# EAGLE design Tanker_Pertamina3 (EAGLE 7.6.0)
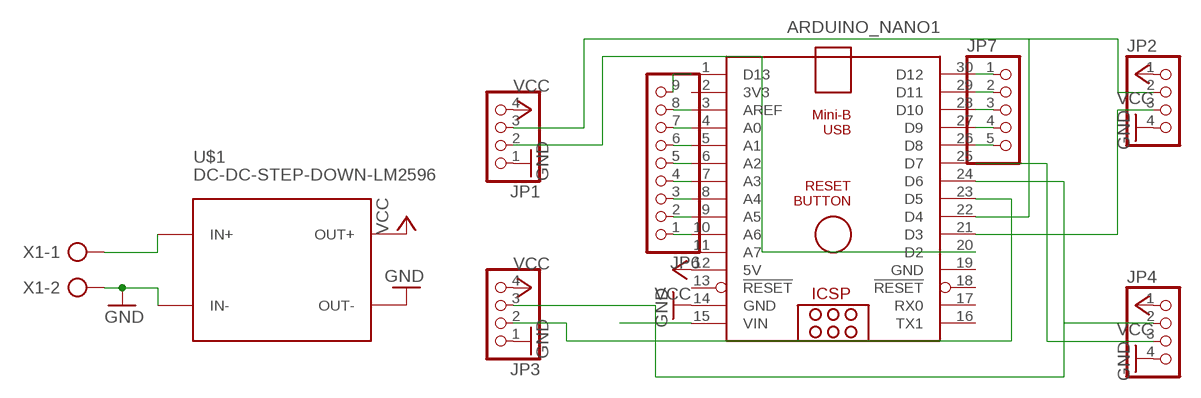
[diagram p0: schematic, sheet 1]

## Parts
ARDUINO_NANO1  ARDUINO_NANO  [ARDUINO_NANO]
JP1  PINHD-1X4  [1X04]
JP2  PINHD-1X4  [1X04]
JP3  PINHD-1X4  [1X04]
JP4  PINHD-1X4  [1X04]
JP6  PINHD-1X9  [1X09]
JP7  PINHD-1X5  [1X05]
U$1  DC-DC-STEP-DOWN-LM2596  [DC-DC-STEP-DOWN-LM2596]
X1  AK300/2  [AK300/2]

## Nets
7-12V: ARDUINO_NANO1.15(VIN)
GND: ARDUINO_NANO1.14(GND) JP1.1 JP2.4 JP3.1 JP4.4 U$1.IN- U$1.OUT- X1.2
N$1: ARDUINO_NANO1.20(D2) JP1.2
N$2: ARDUINO_NANO1.10(A6) JP6.1
N$3: ARDUINO_NANO1.21(D3) JP2.3
N$4: ARDUINO_NANO1.23(D5) JP3.2
N$5: ARDUINO_NANO1.25(D7) JP4.3
N$6: ARDUINO_NANO1.9(A5) JP6.2
N$7: ARDUINO_NANO1.8(A4) JP6.3
N$8: ARDUINO_NANO1.7(A3) JP6.4
N$9: ARDUINO_NANO1.6(A2) JP6.5
N$10: ARDUINO_NANO1.5(A1) JP6.6
N$11: ARDUINO_NANO1.4(A0) JP6.7
N$12: ARDUINO_NANO1.3(AREF) JP6.8
N$13: ARDUINO_NANO1.1(D13) JP6.9
N$14: ARDUINO_NANO1.30(D12) JP7.1
N$15: ARDUINO_NANO1.29(D11) JP7.2
N$16: ARDUINO_NANO1.28(D10) JP7.3
N$17: ARDUINO_NANO1.27(D9) JP7.4
N$18: ARDUINO_NANO1.26(D8) JP7.5
N$19: U$1.IN+ X1.1
TRIG_DEPAN: ARDUINO_NANO1.22(D4) JP1.3 JP2.2
TRIGGER_BELAKANG: ARDUINO_NANO1.24(D6) JP3.3 JP4.2
VCC: ARDUINO_NANO1.12(5V) JP1.4 JP2.1 JP3.4 JP4.1 U$1.OUT+
Unconnected: ARDUINO_NANO1.2(3V3) ARDUINO_NANO1.11(A7) ARDUINO_NANO1.13(!RESET) ARDUINO_NANO1.16(TX1) ARDUINO_NANO1.17(RX0) ARDUINO_NANO1.18(!RESET)

## Power pins joined to a net without a drawn wire
GND: ARDUINO_NANO1.19(GND)

## Library data of the parts
ARDUINO_NANO1 = ArduinoNanoV30:ARDUINO_NANO: Arduino Nano V3.0 Overview: The Arduino Nano is a small, complete, and breadboard-friendly board based on the ATmega328 (Arduino Nano 3.x) or ATmega168 (Arduino Nano 2.x). It has more or less the same functionality of the Arduino Duemilanove, but in a different package. It lacks only a DC power jack, and works with a Mini-B USB cable instead of a standard one. The Nano was designed and is being produced by Gravitech. Specifications: Microcontroller Atmel ATmega168 or ATmega328 Operating Voltage (logic level) 5 V Input Voltage (recommended) 7-12 V Input Voltage (limits) 6-20 V Digital I/O Pins 14 (of which 6 provide PWM output) Analog Input Pins 8 DC Current per I/O Pin 40 mA Flash Memory 16 KB (ATmega168) or 32 KB (ATmega328) of which 2 KB used by bootloader SRAM 1 KB (ATmega168) or 2 KB (ATmega328) EEPROM 512 bytes (ATmega168) or 1 KB (ATmega328) Clock Speed 16 MHz Dimensions 0.73" x 1.70" Length 45 mm Width 18 mm Weigth 5 g Power: The Arduino Nano can be powered via the Mini-B USB connection, 6-20V unregulated external power supply (pin 30), or 5V regulated external power supply (pin 27). The power source is automatically selected to the highest voltage source. Memory: The ATmega168 has 16 KB of flash memory for storing code (of which 2 KB is used for the bootloader); the ATmega328 has 32 KB, (also with 2 KB used for the bootloader). The ATmega168 has 1 KB of SRAM and 512 bytes of EEPROM (which can be read and written with the EEPROM library); the ATmega328 has 2 KB of SRAM and 1 KB of EEPROM. Input and Output: Each of the 14 digital pins on the Nano can be used as an input or output, using pinMode(), digitalWrite(), and digitalRead() functions. They operate at 5 volts. Each pin can provide or receive a maximum of 40 mA and has an internal pull-up resistor (disconnected by default) of 20-50 kOhms. In addition, some pins have specialized functions. Visit Arduino - ArduinoBoardNano <https://www.arduino.cc/en/Main/ArduinoBoardNano>
JP1-JP4 = pinhead:PINHD-1X4: PIN HEADER
JP6 = pinhead:PINHD-1X9: PIN HEADER
JP7 = pinhead:PINHD-1X5: PIN HEADER
U$1 = diy-modules:DC-DC-STEP-DOWN-LM2596: DC/DC Step-Down Regulator based on LM2596-ADJ chip LM2596 datasheet available here: http://www.ti.com/lit/ds/symlink/lm2596.pdf Click here to find device on ebay.com <http://www.ebay.com/sch/lm2596+power+regulator>
X1 = con-ptr500:AK300/2: CONNECTOR; OC_FARNELL: unknown; OC_NEWARK: unknown

## Board
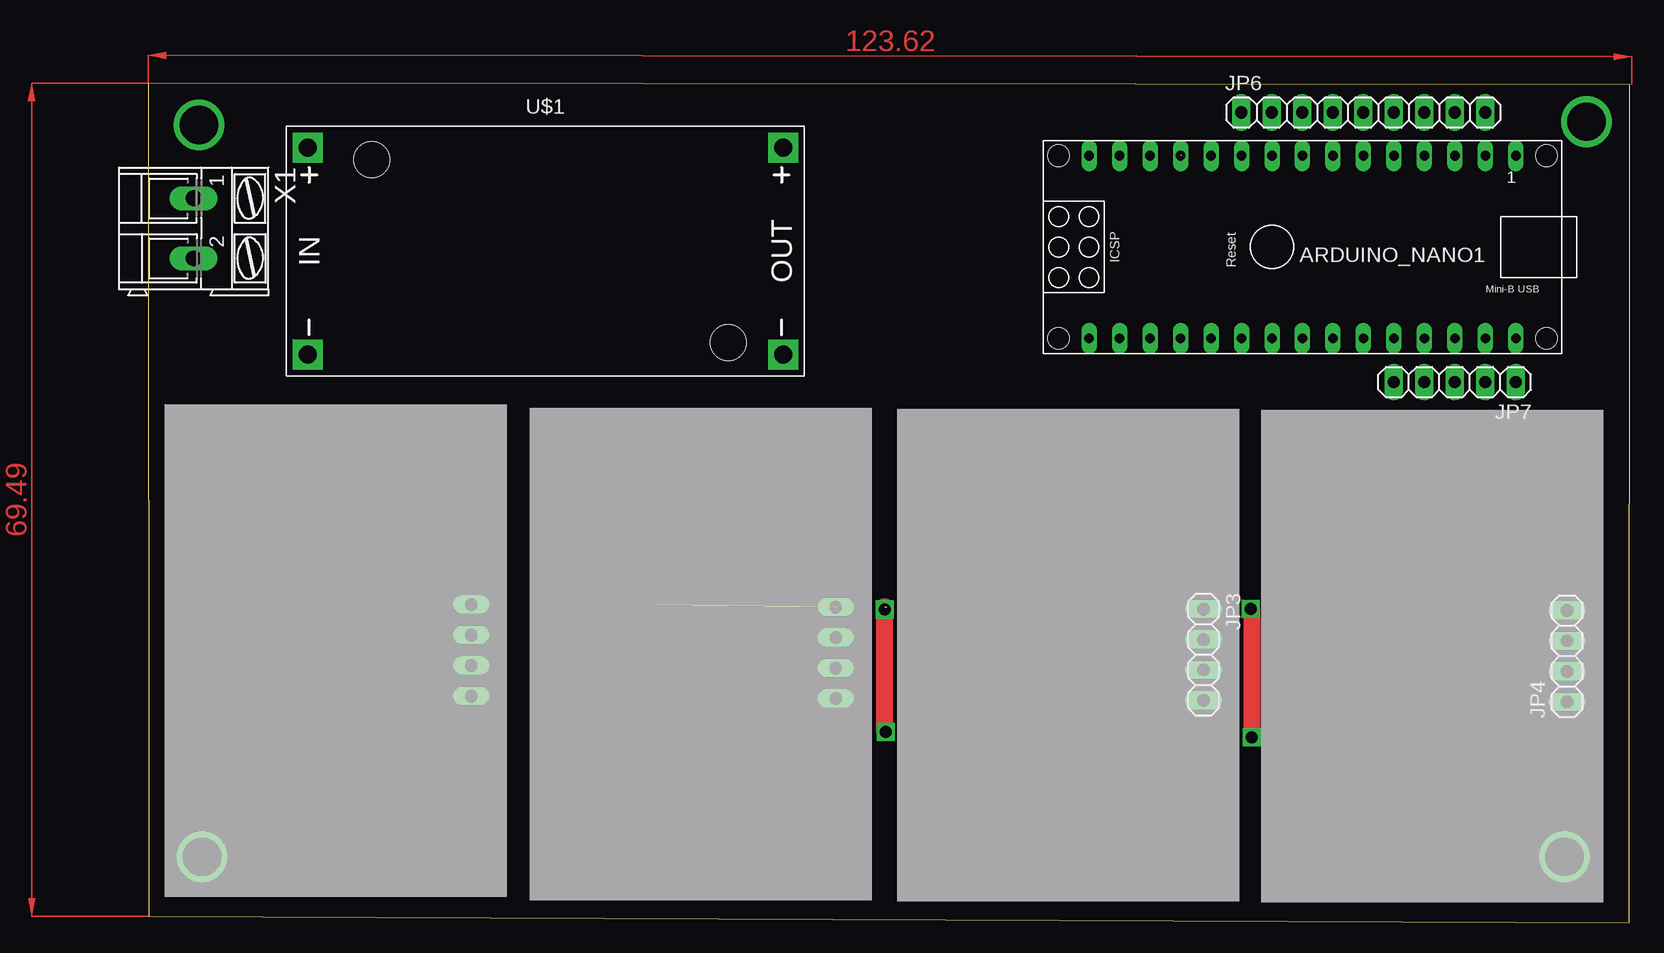
[diagram p1: board, top side]
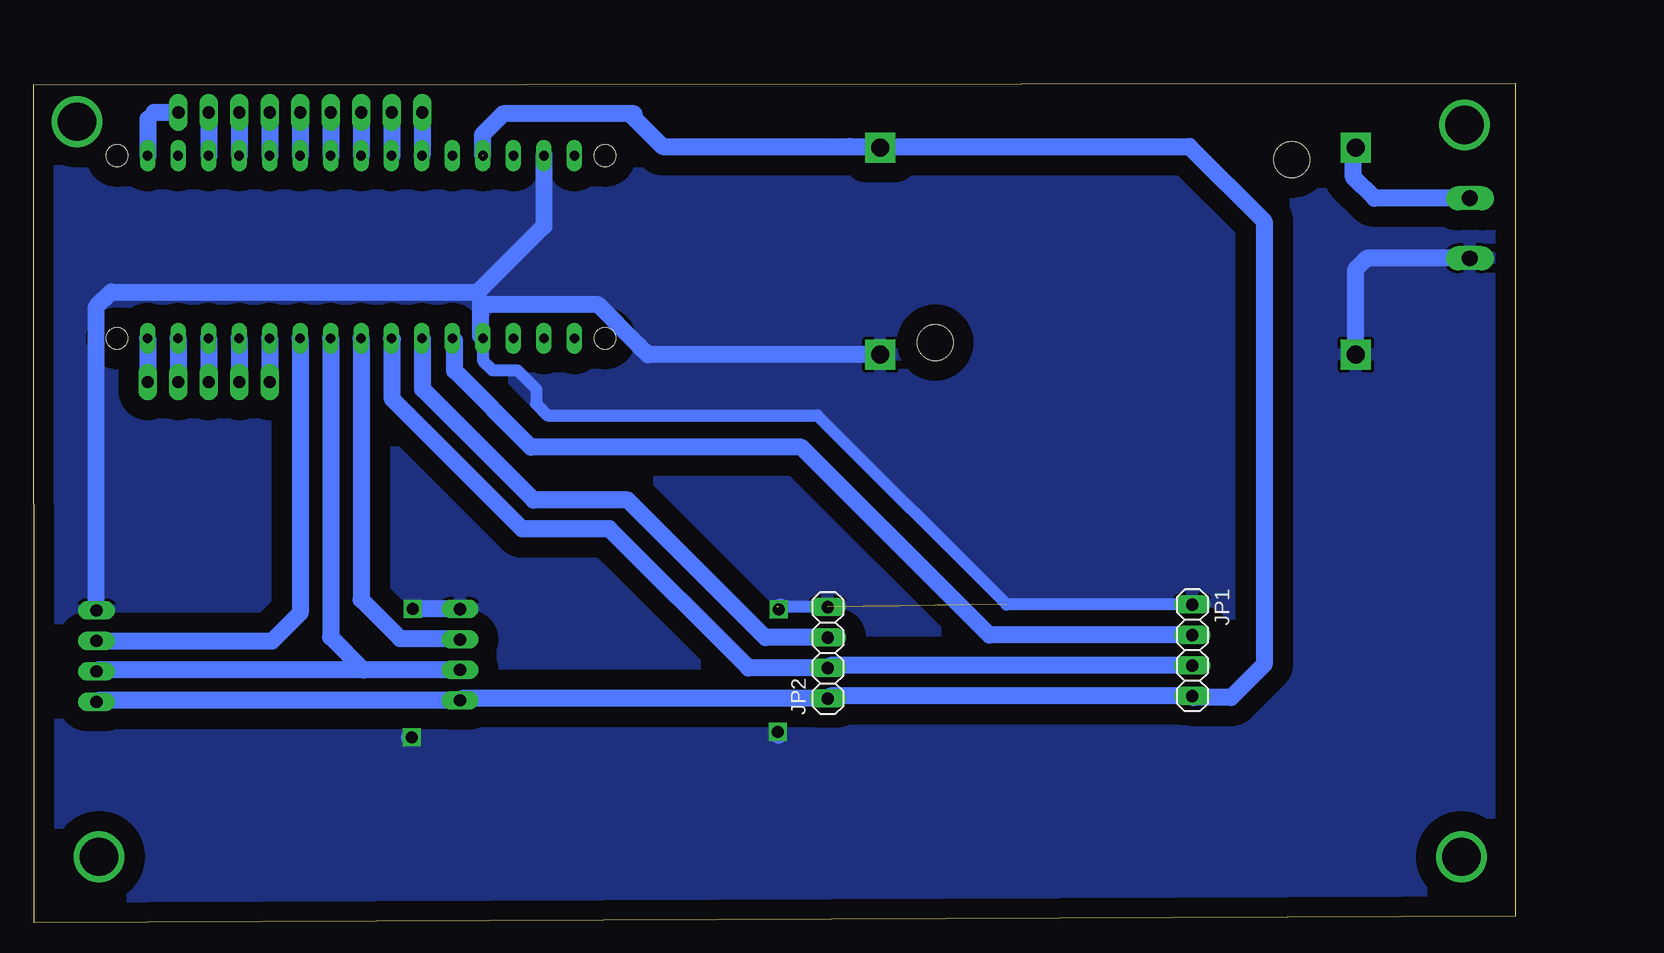
[diagram p2: board, bottom side, seen from below]

Size 123.42 x 70.02 mm. Coordinates in mm from the lower left corner, seen from the top.
Outline: 0.01,0.52 123.4,0 123.42,69.88 0,70.02 0.01,0.52
Copper layers (1*16): Top 0.035mm / dielectric 1.5mm / Bottom 0.035mm
Design rules "default": minimum track width 10mil, minimum drill 24mil, track to track 8mil, track to pad 8mil, pad to pad 8mil, via to via 8mil, smd to smd 8mil, copper to edge 40mil, drill to drill 8mil, minimum pad ring 10mil, minimum via ring 8mil, stop-mask expansion 4mil, vias tented up to drill 0mil, thermal gap 10mil

### Footprints (pad centres in the part's own frame; a part is rotated, then mirrored left to right if it is on the bottom)
ARDUINO_NANO = drill 0.8 long: 1 -20.32,-7.62; 2 -17.78,-7.62; 3 -15.24,-7.62; 4 -12.7,-7.62; 5 -10.16,-7.62; 6 -7.62,-7.62; 7 -5.08,-7.62; 8 -2.54,-7.62; 9 0,-7.62; 10 2.54,-7.62; 11 5.08,-7.62; 12 7.62,-7.62; 13 10.16,-7.62; 14 12.7,-7.62; 15 15.24,-7.62; 16 15.24,7.62; 17 12.7,7.62; 18 10.16,7.62; 19 7.62,7.62; 20 5.08,7.62; 21 2.54,7.62; 22 0,7.62; 23 -2.54,7.62; 24 -5.08,7.62; 25 -7.62,7.62; 26 -10.16,7.62; 27 -12.7,7.62; 28 -15.24,7.62; 29 -17.78,7.62; 30 -20.32,7.62 | hole 1.778: -22.86,-7.62; -22.86,7.62; 17.78,7.62; 17.78,-7.62
1X04 = drill 1.016 long: 1 -3.81,0; 2 -1.27,0; 3 1.27,0; 4 3.81,0
1X09 = drill 1.016 long: 1 -10.16,0; 2 -7.62,0; 3 -5.08,0; 4 -2.54,0; 5 0,0; 6 2.54,0; 7 5.08,0; 8 7.62,0; 9 10.16,0
1X05 = drill 1.016 long: 1 -5.08,0; 2 -2.54,0; 3 0,0; 4 2.54,0; 5 5.08,0
DC-DC-STEP-DOWN-LM2596 = drill 1.5 pad 2.5 square: IN+ -19.812,8.636; IN- -19.812,-8.636; OUT+ 19.812,8.636; OUT- 19.812,-8.636 | hole 3: -14.478,7.62; 15.24,-7.62
AK300/2 = drill 1.321 long: 1 -2.515,0; 2 2.489,0

### Placement (x,y rotation side)
ARDUINO_NANO1  93.63,56.34 180 top
JP1  26.9,22.71 270 bottom
JP2  57.27,22.5 90 bottom
JP3  87.92,22.34 270 top
JP4  118.22,22.23 90 top
JP6  101.23,67.56 0 top
JP7  108.85,45.07 180 top
U$1  33.08,56 0 top
X1  3.77,57.89 270 top

### Tracks (layer width: path | path; a pad name or v marks a point on that pad's centre or on a via)
GND  (via drill 1)  (2 unrouted)
  Top 1.422: v61.37,26.13 61.37,26.29 61.32,26.35 61.32,16.01 v61.43,15.89 | v91.88,26.18 91.94,26.18 v91.94,15.45
  Bottom 1.016: 86.22,52.79 86.22,52.46 | 86.22,52.46 86.22,51.61 86.13,51.52 | 86.22,48.92 ARDUINO_NANO1.19 86.01,46.88 85.21,46.08 83.16,46.08 81.59,44.5 81.59,43.26 80.64,42.31 58.15,42.31 42.36,26.52 JP1.1 | 72.64,47.76 73.02,48.13 | 86.35,52.59 86.22,52.46 | 61.51,26.31 61.51,25.9 | JP2.4 61.37,26.31 v61.37,26.13
  Bottom 1.422: ARDUINO_NANO1.14 80.93,58.08 86.22,52.79 | 86.22,51.61 86.22,48.92 | 86.13,51.52 76.41,51.52 73.02,48.13 72.25,47.37 U$1.OUT- | JP4.4 118.22,51.35 116.98,52.59 86.35,52.59 | 61.2,26.31 v61.37,26.13 | v61.43,15.89 61.43,15.7 61.37,15.64 | JP3.1 91.85,26.15 v91.88,26.18 | v91.94,15.45 92.13,15.45 | X1.2 12.35,55.4 13.27,54.48 U$1.IN-
  pour Bottom (isolate 1.676): 123.62,69.9 123.62,0.36 0.9,0.62 0.9,70.17
N$1
  Bottom 1.016: 88.38,48.54 ARDUINO_NANO1.20
  Bottom 1.422: JP1.2 43.81,23.98 59.5,39.66 82.02,39.66 88.38,46.02 88.38,48.54
N$2
  Bottom 1.016: 91.07,63.98 ARDUINO_NANO1.10
  Bottom 1.422: JP6.1 91.07,63.98
N$3
  Bottom 1.016: 91.03,48.65 ARDUINO_NANO1.21
  Bottom 1.422: JP2.3 62.47,23.77 73.94,35.24 81.78,35.24 91.03,44.49 91.03,48.65
N$4
  Bottom 1.016: 88.02,23.7 JP3.2
  Bottom 1.422: ARDUINO_NANO1.23 96.17,26.96 92.92,23.7 88.02,23.7
N$5
  Bottom 1.016: 118.19,23.47 JP4.3
  Bottom 1.422: ARDUINO_NANO1.25 101.25,25.83 103.6,23.47 118.19,23.47
N$6
  Bottom 1.016: 93.61,63.98 ARDUINO_NANO1.9
  Bottom 1.422: JP6.2 93.61,63.98
N$7
  Bottom 1.016: 96.15,63.98 ARDUINO_NANO1.8
  Bottom 1.422: JP6.3 96.15,63.98
N$8
  Bottom 1.016: 98.69,63.98 ARDUINO_NANO1.7
  Bottom 1.422: JP6.4 98.69,63.98
N$9
  Bottom 1.016: 101.23,63.98 ARDUINO_NANO1.6
  Bottom 1.422: JP6.5 101.23,63.98
N$10
  Bottom 1.016: 103.77,63.98 ARDUINO_NANO1.5
  Bottom 1.422: JP6.6 103.77,63.98
N$11
  Bottom 1.016: 106.31,63.98 ARDUINO_NANO1.4
  Bottom 1.422: JP6.7 106.31,63.98
N$12
  Bottom 1.016: 108.85,63.98 ARDUINO_NANO1.3
  Bottom 1.422: JP6.8 108.85,63.98
N$13
  Bottom 1.016: 113.41,67.56 113.94,67.03 | ARDUINO_NANO1.1
  Bottom 1.422: JP6.9 113.41,67.56 | 113.94,67.03 ARDUINO_NANO1.1
N$14
  Bottom 1.016: 113.95,45.09 JP7.1
  Bottom 1.422: ARDUINO_NANO1.30 113.95,45.09
N$15
  Bottom 1.016: 111.41,45.09 JP7.2
  Bottom 1.422: ARDUINO_NANO1.29 111.41,45.09
N$16
  Bottom 1.016: 108.87,45.09 JP7.3
  Bottom 1.422: ARDUINO_NANO1.28 108.87,45.09
N$17
  Bottom 1.016: 106.33,45.09 JP7.4
  Bottom 1.422: ARDUINO_NANO1.27 106.33,45.09
N$18
  Bottom 1.016: 103.79,45.09 JP7.5
  Bottom 1.422: ARDUINO_NANO1.26 103.79,45.09
N$19
  Bottom 1.422: X1.1 11.71,60.4 13.46,62.15 13.46,64.44 U$1.IN+
N$20  (via drill 3.2)
  other vias: 4.21,66.53
N$21  (via drill 3.2)
  other vias: 4.47,5.5
N$22  (via drill 3.2)
  other vias: 118,5.5
N$23  (via drill 3.2)
  other vias: 119.84,66.79
TRIG_DEPAN
  Bottom 1.016: 57.06,21.44 JP2.2
  Bottom 1.422: JP1.3 57.06,21.44 | JP2.2 63.86,21.23 75.46,32.83 82.74,32.83 93.55,43.65 93.55,48.64 ARDUINO_NANO1.22
TRIGGER_BELAKANG
  Bottom 1.016: 118.11,21.07 JP4.2
  Bottom 1.422: JP3.3 95.97,21.07 | 95.97,21.07 118.11,21.07 | ARDUINO_NANO1.24 98.71,23.82 95.97,21.07
VCC  (1 unrouted)
  Bottom 1.016: 57.06,18.9 JP2.1 | 87.76,18.69 JP3.4 | 118.11,18.53 JP4.1 | 73.41,67.44 73.41,67.09 | 26.78,18.79 JP1.4 | U$1.OUT+ 55.38,64.64 55.45,64.71
  Bottom 1.422: 73.41,67.44 84.32,67.44 86.06,65.7 86.06,64.01 | JP1.4 57.06,18.9 | JP2.1 87.76,18.69 | JP3.4 118.11,18.53 | 73.41,67.09 71.03,64.71 55.45,64.71 27.14,64.71 20.91,58.49 20.91,21.54 23.66,18.79 26.78,18.79
(copper drawn outside any net)
  shapes: Top area x2